# EAGLE design ozino.xyz.red (EAGLE 8.1.1)
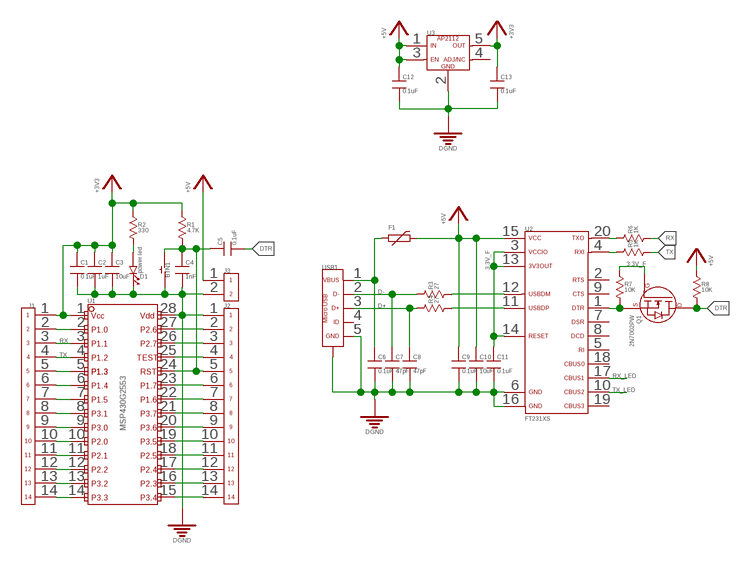
[diagram p0: schematic, sheet 1]

## Parts
BTN1  BTN_NORMAL_OFF_6_3.5_SMD  [BTN_6_3.5_SMD]
C1  0.1uF  CAPACITOR_FIXED_0402  [0402]
C2  1uF  CAPACITOR_FIXED_0402  [0402]
C3  10uF  CAPACITOR_FIXED_0402  [0402]
C4  1nF  CAPACITOR_FIXED_0402  [0402]
C5  0.1uF  CAPACITOR_FIXED_0402  [0402]
C6  0.1uF  CAPACITOR_FIXED_0402  [0402]
C7  47pF  CAPACITOR_FIXED_0402  [0402]
C8  47pF  CAPACITOR_FIXED_0402  [0402]
C9  0.1uF  CAPACITOR_FIXED_0402  [0402]
C10  10uF  CAPACITOR_FIXED_0402  [0402]
C11  0.1uF  CAPACITOR_FIXED_0402  [0402]
C12  0.1uF  CAPACITOR_FIXED_0402  [0402]
C13  0.1uF  CAPACITOR_FIXED_0402  [0402]
D1  power led  LED-0805  [0805DIODE]
F1  PTC_0805  [0805]
J1  14PIN_HEADER_PITCH2.54MM_TH  [14PIN_HEADER_PITCH2.54MM_TH]
J2  14PIN_HEADER_PITCH2.54MM_TH  [14PIN_HEADER_PITCH2.54MM_TH]
J3  2PIN_HEADER_PITCH2.54MM_TH  [2PIN_HEADER_PITCH2.54MM_TH]
Q1  2N7002PW  [SOT323(SC-70)]
R1  4.7K  RESISTOR_0402  [0402]
R2  330  RESISTOR_0805  [0805]
R3  27  RESISTOR_0402  [0402]
R4  27  RESISTOR_0402  [0402]
R5  1K  RESISTOR_0402  [0402]
R6  1K  RESISTOR_0402  [0402]
R7  10K  RESISTOR_0402  [0402]
R8  10K  RESISTOR_0402  [0402]
U1  MSP430G2553_24IO_28PIN_TSSOP  [TSSOP-28]
U2  FT231XS_SSOP20  [SSOP-20]
U3  AP2112K_SOT-23-5  [SOT-23-5]
USB1  USB-2.0-MICRO_SMD_SMD  [MICRO-USB-B-SMD-SMD]

## Nets
3.3V_F: C11.1 Q1.1(G) R7.1 U2.3 U2.13 U2.14
+3V3: C1.1 C2.1 C3.1 C13.1 J1.1 R1.1 R2.1 U1.1 U3.5
+5V: C9.1 C10.1 C12.1 F1.2 J3.1 R8.1 U2.15 U3.1 U3.3
D+: C8.1 R4.1 USB1.3(D+)
D-: C7.1 R3.1 USB1.2(D-)
DGND: BTN1.1 C1.2 C2.2 C3.2 C4.2 C6.2 C7.2 C8.2 C9.2 C10.2 C11.2 C12.2 C13.2 D1.1(K) J2.1 J3.2 U1.28 U2.16 U3.2 USB1.5(GND) USB1.M1(SHIELD) USB1.M2(SHIELD) USB1.M3(SHIELD) USB1.M4(SHIELD) USB1.S1(SHIELD) USB1.S2(SHIELD)
DTR: C5.2 Q1.3(D) R8.2
N$1: R3.2 U2.12
N$2: D1.2(A) R2.2
N$3: R4.2 U2.11
N$4: C6.1 F1.1 USB1.1(VBUS)
N$5: R6.1 U2.20
N$6: R5.1 U2.4
N$9: Q1.2(S) R7.2 U2.1
P1.0: J1.2 U1.2
P1.3: J1.5 U1.5
P1.4: J1.6 U1.6
P1.5: J1.7 U1.7
P1.7: J2.6 U1.23
P2.0: J1.10 U1.10
P2.1: J1.11 U1.11
P2.2: J1.12 U1.12
P2.3: J2.13 U1.16
P2.4: J2.12 U1.17
P2.5: J2.11 U1.18
P2.6: J2.2 U1.27
P2.7: J2.3 U1.26
P3.0: J1.9 U1.9
P3.1: J1.8 U1.8
P3.2: J1.13 U1.13
P3.3: J1.14 U1.14
P3.4: J2.14 U1.15
P3.5: J2.10 U1.19
P3.6: J2.9 U1.20
P3.7: J2.8 U1.21
P`.6: J2.7 U1.22
RST: BTN1.2 C4.1 C5.1 J2.5 R1.2 U1.24
RX: J1.3 R6.2 U1.3
RX_LED: U2.17
TEST: J2.4 U1.25
TX: J1.4 R5.2 U1.4
TX_LED: U2.10
Unconnected: U2.2 U2.5 U2.6 U2.7 U2.8 U2.9 U2.18 U2.19 U3.4 USB1.4(ID)

## Library data of the parts
BTN1 = Switches:BTN_NORMAL_OFF
C1-C13 = Capacitors:CAPACITOR_FIXED
D1 = LEDs:LED
F1 = Fuse:PTC
J1 J2 = Connectors:14PIN
J3 = Connectors:2PIN
Q1 = FETs:2N7002PW
R1-R8 = Resistors:RESISTOR
U1 = MCUs:MSP430G2553_24IO_28PIN
U2 = FTDI:FT231XS
U3 = Power Supplies:AP2112K
USB1 = Connectors:USB-2.0-MICRO

## Board
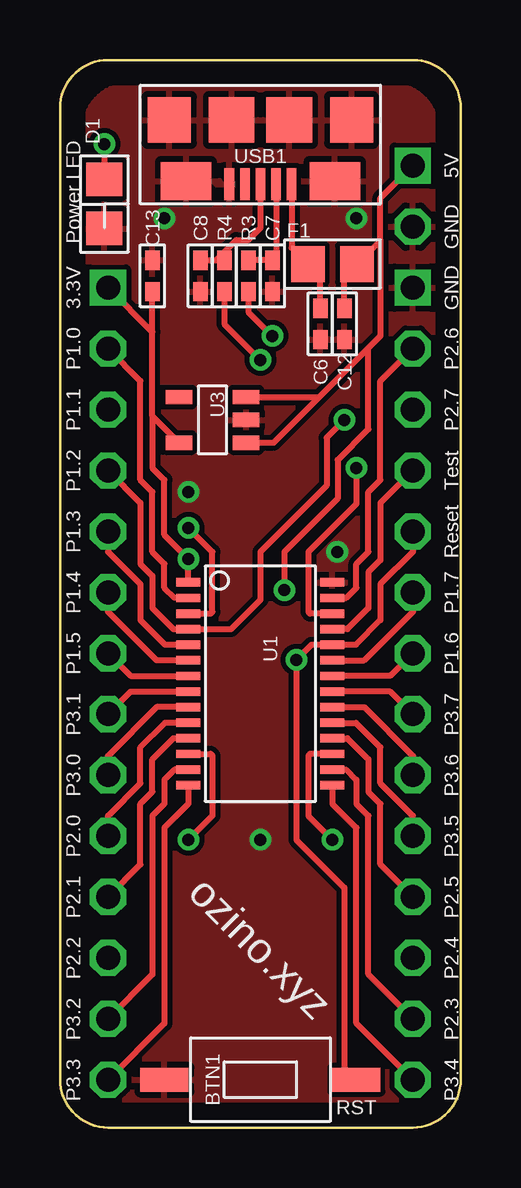
[diagram p1: board, top side]
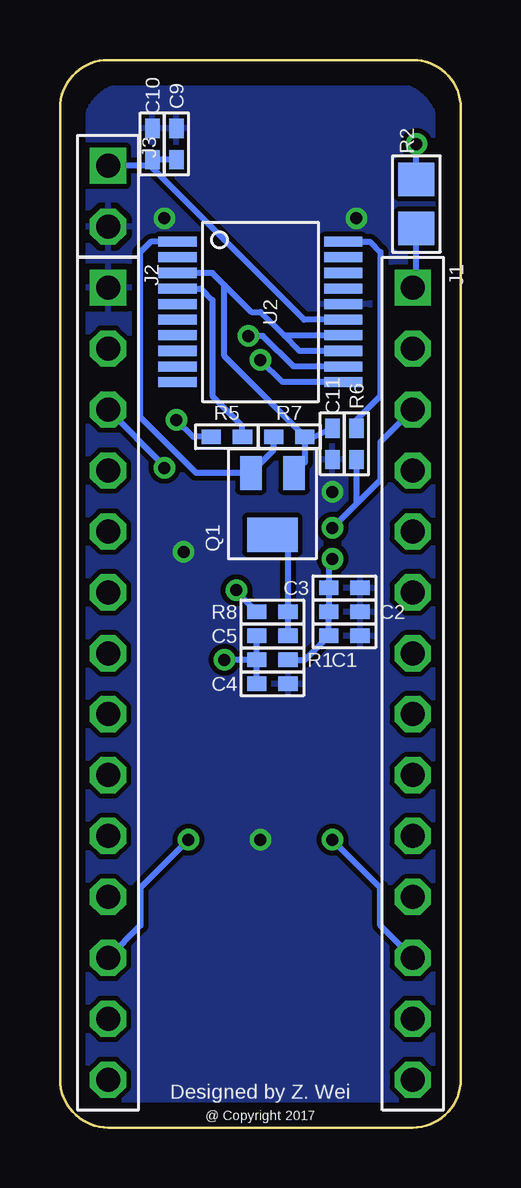
[diagram p2: board, bottom side, seen from below]

Size 16.7 x 44.5 mm. Coordinates in mm from the lower left corner, seen from the top.
Outline: 0,42.5 0,2 arc90 2,0 14.7,0 arc90 16.7,2 16.7,42.5 arc90 14.7,44.5 2,44.5 arc90 0,42.5
Copper layers (1*16): Top 0.035mm / dielectric 1.5mm / Bottom 0.035mm
Design rules "default *": minimum track width 10mil, minimum drill 24mil, track to track 8mil, track to pad 8mil, pad to pad 8mil, via to via 8mil, smd to smd 8mil, copper to edge 1mm, drill to drill 8mil, minimum pad ring 10mil, minimum via ring 8mil, stop-mask expansion 4mil, vias tented up to drill 0mil, thermal gap 10mil

### Footprints (pad centres in the part's own frame; a part is rotated, then mirrored left to right if it is on the bottom)
BTN_6_3.5_SMD = smd 1 x 2: 1 0,4; 2 0,-4
0402 = smd 0.8 x 0.6: 1 -0.65,0; 2 0.65,0
0805DIODE = smd 1.4 x 1.5: 1 -1.025,0; 2 1.025,0
0805 = smd 1.4 x 1.5: 1 -1.025,0; 2 1.025,0
14PIN_HEADER_PITCH2.54MM_TH = drill 1 square: 1 -16.51,0 | drill 1 octagon: 2 -13.97,0; 3 -11.43,0; 4 -8.89,0; 5 -6.35,0; 6 -3.81,0; 7 -1.27,0; 8 1.27,0; 9 3.81,0; 10 6.35,0; 11 8.89,0; 12 11.43,0; 13 13.97,0; 14 16.51,0
2PIN_HEADER_PITCH2.54MM_TH = drill 1 square: 1 -1.27,0 | drill 1 octagon: 2 1.27,0
SOT323(SC-70) = smd 1.425 x 0.9: 1 1.288,-0.9; 2 1.288,0.9 | smd 1.425 x 2.1: 3 -1.288,0
TSSOP-28 = smd 0.35 x 1: 1 -4.225,-3; 2 -3.575,-3; 3 -2.925,-3; 4 -2.275,-3; 5 -1.625,-3; 6 -0.975,-3; 7 -0.325,-3; 8 0.325,-3; 9 0.975,-3; 10 1.625,-3; 11 2.275,-3; 12 2.925,-3; 13 3.575,-3; 14 4.225,-3; 15 4.225,3; 16 3.575,3; 17 2.925,3; 18 2.275,3; 19 1.625,3; 20 0.975,3; 21 0.325,3; 22 -0.325,3; 23 -0.975,3; 24 -1.625,3; 25 -2.275,3; 26 -2.925,3; 27 -3.575,3; 28 -4.225,3
SSOP-20 = smd 0.42 x 1.6: 1 -2.925,-3.45; 2 -2.275,-3.45; 3 -1.625,-3.45; 4 -0.975,-3.45; 5 -0.325,-3.45; 6 0.325,-3.45; 7 0.975,-3.45; 8 1.625,-3.45; 9 2.275,-3.45; 10 2.925,-3.45; 11 2.925,3.45; 12 2.275,3.45; 13 1.625,3.45; 14 0.975,3.45; 15 0.325,3.45; 16 -0.325,3.45; 17 -0.975,3.45; 18 -1.625,3.45; 19 -2.275,3.45; 20 -2.925,3.45
SOT-23-5 = smd 0.6 x 1.1: 1 -0.95,-1.4; 2 0,-1.4; 3 0.95,-1.4; 4 0.95,1.4; 5 -0.95,1.4
MICRO-USB-B-SMD-SMD = smd 0.4 x 1.35: 1 -1.3,2.675; 2 -0.65,2.675; 3 0,2.675; 4 0.65,2.675; 5 1.3,2.675 | smd 2.1 x 1.6: M1 -3.1,2.55; M2 3.1,2.55 | smd 1.8 x 1.9: M3 -3.8,0; M4 3.8,0 | smd 1.9 x 1.9: S1 -1.2,0; S2 1.2,0

### Placement (x,y rotation side)
BTN1  8.35,2 90 top
C1  4.85,20.5 0 bottom
C2  4.85,21.5 0 bottom
C3  4.85,22.5 0 bottom
C4  7.85,18.5 0 bottom
C5  7.85,20.5 0 bottom
C6  10.85,33.5 270 top
C7  8.85,35.5 270 top
C8  5.85,35.5 270 top
C9  11.85,41 90 bottom
C10  12.85,41 90 bottom
C11  5.35,28.5 270 bottom
C12  11.85,33.5 270 top
C13  3.85,35.5 90 top
D1  1.85,38.5 90 top
F1  11.35,36 0 top
J1  2,18.5 270 bottom
J2  14.7,18.5 270 bottom
J3  14.7,38.82 270 bottom
Q1  7.85,26 90 bottom
R1  7.85,19.5 180 bottom
R2  1.85,38.5 90 bottom
R3  7.85,35.5 270 top
R4  6.85,35.5 270 top
R5  9.75,28.8 180 bottom
R6  4.35,28.5 270 bottom
R7  7.15,28.8 180 bottom
R8  7.85,21.5 0 bottom
U1  8.35,18.5 270 top
U2  8.35,34 270 bottom
U3  6.35,29.5 90 top
USB1  8.35,42 180 top

### Tracks (layer width: path | path; a pad name or v marks a point on that pad's centre or on a via)
3.3V_F
  Bottom 0.254: Q1.1 6.5,27.74 R7.1 | R7.1 9.85,32.15 9.85,35.12 | C11.1 6.35,28.65 R7.1 | 7.38,33.02 U2.14 | 7.38,33.02 8.35,34 8.72,34 9.85,35.12 | U2.3 10.35,35.62 9.85,35.12 | U2.13 6.72,32.38 7.38,33.02
+3V3  (via drill 0.5)
  Top 0.254: U1.1 v5.35,23.7 4.35,24.7 4.35,27 3.85,27.5 3.85,29.65 | 3.85,29.65 3.85,33.16 | 3.85,33.16 C13.1 | J1.1 3.85,33.16 | U3.5 3.85,29.65
  Bottom 0.254: v5.35,23.7 5.5,23.55 C3.1 C2.1 C1.1 6.5,19.5 R1.1 | J1.1 1.85,35.16 R2.1
+5V  (via drill 0.5)
  Top 0.254: v9.35,22.4 9.35,24 11.57,26.22 11.57,27.82 12.85,29.11 12.85,32.5 | U3.3 10.8,30.45 | U3.1 8.9,28.55 10.8,30.45 | 12.85,32.5 10.8,30.45 | 12.85,32.5 13.35,33 13.35,36.98 | 13.35,36.98 13.35,38.74 J3.1 | C12.1 11.85,35.48 F1.2 13.35,36.98
  Bottom 0.254: v9.35,22.4 9.35,22.35 R8.1 | U2.15 6.52,33.67 12.94,40.09 13.11,40.09 | 13.11,40.09 J3.1 | C9.1 C10.1 13.11,40.09
D+
  Top 0.254: USB1.3 8.35,37.5 7.85,37 7.35,37 6.85,36.5 | R4.1 6.85,36.5 | C8.1 6.5,36.15 6.85,36.5
D-
  Top 0.254: USB1.2 9,36.3 C7.1 R3.1
DGND  (via drill 0.5)
  other vias: 11.55,24 8.35,12 5.35,26.5 12.35,37.9 4.35,37.9
  pour Bottom: 15.7,41.5 15.7,3 arc-90 13.7,1 3,1 arc-90 1,3 1,41.5 arc-90 3,43.5 13.7,43.5 arc-90
  pour Top: 15.7,41.5 15.7,3 arc-90 13.7,1 3,1 arc-90 1,3 1,41.5 arc-90 3,43.5 13.7,43.5 arc-90
DTR
  Bottom 0.254: C5.2 R8.2 7.2,24.06 Q1.3
N$1  (via drill 0.5)
  Top 0.254: R3.2 7.85,34 v8.85,33
  Bottom 0.254: U2.12 6.97,31.73 8.24,33 v8.85,33
N$2  (via drill 0.5)
  Top 0.254: v1.85,41 D1.2
  Bottom 0.254: D1.2 v1.85,41
N$3  (via drill 0.5)
  Top 0.254: R4.2 6.85,33.5 v8.35,32
  Bottom 0.254: U2.11 7.42,31.07 v8.35,32
N$4
  Top 0.254: USB1.1 9.65,36.67 F1.1 10.85,35.48 C6.1
N$5
  Bottom 0.254: U2.20 3.77,36.92 3.35,36.5 3.35,30.5 4.35,29.5 R6.1
N$6
  Bottom 0.254: R5.1 9.1,29.25 10.35,30.5 10.35,34.5 10.82,34.98 U2.4
N$9
  Bottom 0.254: U2.1 12.93,36.92 13.35,36.5 13.35,29.61 11.03,27.29 Q1.2 7.8,28.24 R7.2
P1.0
  Top 0.254: U1.2 4.77,22.07 4.35,22.5 4.35,23.5 3.85,24 3.85,26.5 3.35,27 3.35,31.12 J1.2
P1.3
  Top 0.254: U1.5 4.38,20.12 3.35,21.15 3.35,22.65 2,24 J1.5
P1.4
  Top 0.254: U1.6 4.02,19.48 2,21.5 J1.6
P1.5
  Top 0.254: U1.7 2.94,18.82 J1.7
P1.7
  Top 0.254: U1.23 12.68,19.48 14.7,21.5 J2.6
P2.0
  Top 0.254: U1.10 4.38,16.88 3.35,15.85 3.35,14.35 2,13 J1.10
P2.1
  Top 0.254: U1.11 4.72,16.23 3.85,15.35 3.85,14 3.35,13.5 3.35,10.96 J1.11
P2.2  (via drill 0.5)
  Top 0.254: U1.12 6.27,15.57 6.35,15.5 6.35,13 v5.35,12
  Bottom 0.254: J1.12 3.35,8.42 3.35,10 v5.35,12
P2.3
  Top 0.254: U1.16 11.93,14.93 12.35,14.5 12.35,13.5 12.85,13 12.85,6.38 J2.13
P2.4  (via drill 0.5)
  Top 0.254: U1.17 10.43,15.57 10.35,15.5 10.35,13 v11.35,12
  Bottom 0.254: v11.35,12 13.35,10 13.35,8.42 J2.12
P2.5
  Top 0.254: U1.18 11.97,16.23 12.85,15.35 12.85,14 13.35,13.5 13.35,10.96 J2.11
P2.6
  Top 0.254: U1.27 11.93,22.07 12.35,22.5 12.35,23.5 12.85,24 12.85,26.5 13.35,27 13.35,31.12 J2.2
P2.7  (via drill 0.5)
  Top 0.254: U1.26 10.43,21.43 10.35,21.5 10.35,24 12.35,26 v12.35,27.5
  Bottom 0.254: J2.3 12.35,27.58 v12.35,27.5
P3.0
  Top 0.254: U1.9 4.02,17.52 2,15.5 J1.9
P3.1
  Top 0.254: U1.8 2.94,18.18 J1.8
P3.2
  Top 0.254: U1.13 4.77,14.93 4.35,14.5 4.35,13.5 3.85,13 3.85,6.38 J1.13
P3.3
  Top 0.254: U1.14 5.35,13.5 4.35,12.5 4.35,4.34 J1.14
P3.4
  Top 0.254: U1.15 11.35,13.5 12.35,12.5 12.35,4.34 J2.14
P3.5
  Top 0.254: U1.19 12.32,16.88 13.35,15.85 13.35,14.35 14.7,13 J2.10
P3.6
  Top 0.254: U1.20 12.68,17.52 14.7,15.5 J2.9
P3.7
  Top 0.254: U1.21 13.75,18.18 J2.8
P`.6
  Top 0.254: U1.22 13.75,18.82 J2.7
RST  (via drill 0.5)
  Top 0.254: J2.5 14.7,24 13.35,22.65 13.35,21.15 12.32,20.12 U1.24 10.47,20.12 v9.85,19.5 9.85,12 11.85,10 11.85,2.5 BTN1.2
  Bottom 0.254: C4.1 R1.2 | R1.2 C5.1 | R1.2 v9.85,19.5
RX  (via drill 0.5)
  Top 0.254: v5.35,25 6.35,24 6.35,21.5 6.27,21.43 U1.3
  Bottom 0.254: J1.3 3.35,28.58 3.35,27 v5.35,25 4.35,26 R6.2
TEST
  Top 0.254: U1.25 11.97,20.77 12.85,21.65 12.85,23.15 13.35,23.65 13.35,26.04 J2.4
TX  (via drill 0.5)
  Top 0.254: J1.4 3.35,26.04 3.35,23.5 3.85,23 3.85,21.65 4.72,20.77 U1.4 7.12,20.77 8.35,22 8.35,24 11.11,26.76 11.11,28.76 v11.85,29.5
  Bottom 0.254: R5.2 11.15,28.8 v11.85,29.5

### Text on the board
tPlace: 5V | Power LED | GND | 3.3V | GND | P1.0 | P2.6 | P1.1 | P2.7 | P1.2 | Test | P1.3 | Reset | P1.4 | P1.7 | P1.5 | P1.6 | P3.1 | P3.7 | P3.0 | P3.6 | P2.0 | P3.5 | P2.1 | P2.5 | P2.2 | ozino.xyz | P2.4 | P3.2 | P2.3 | P3.3 | P3.4 | RST
bPlace: Designed by Z. Wei | @ Copyright 2017